# EAGLE design ppm_to_spektrum (EAGLE 5.11)
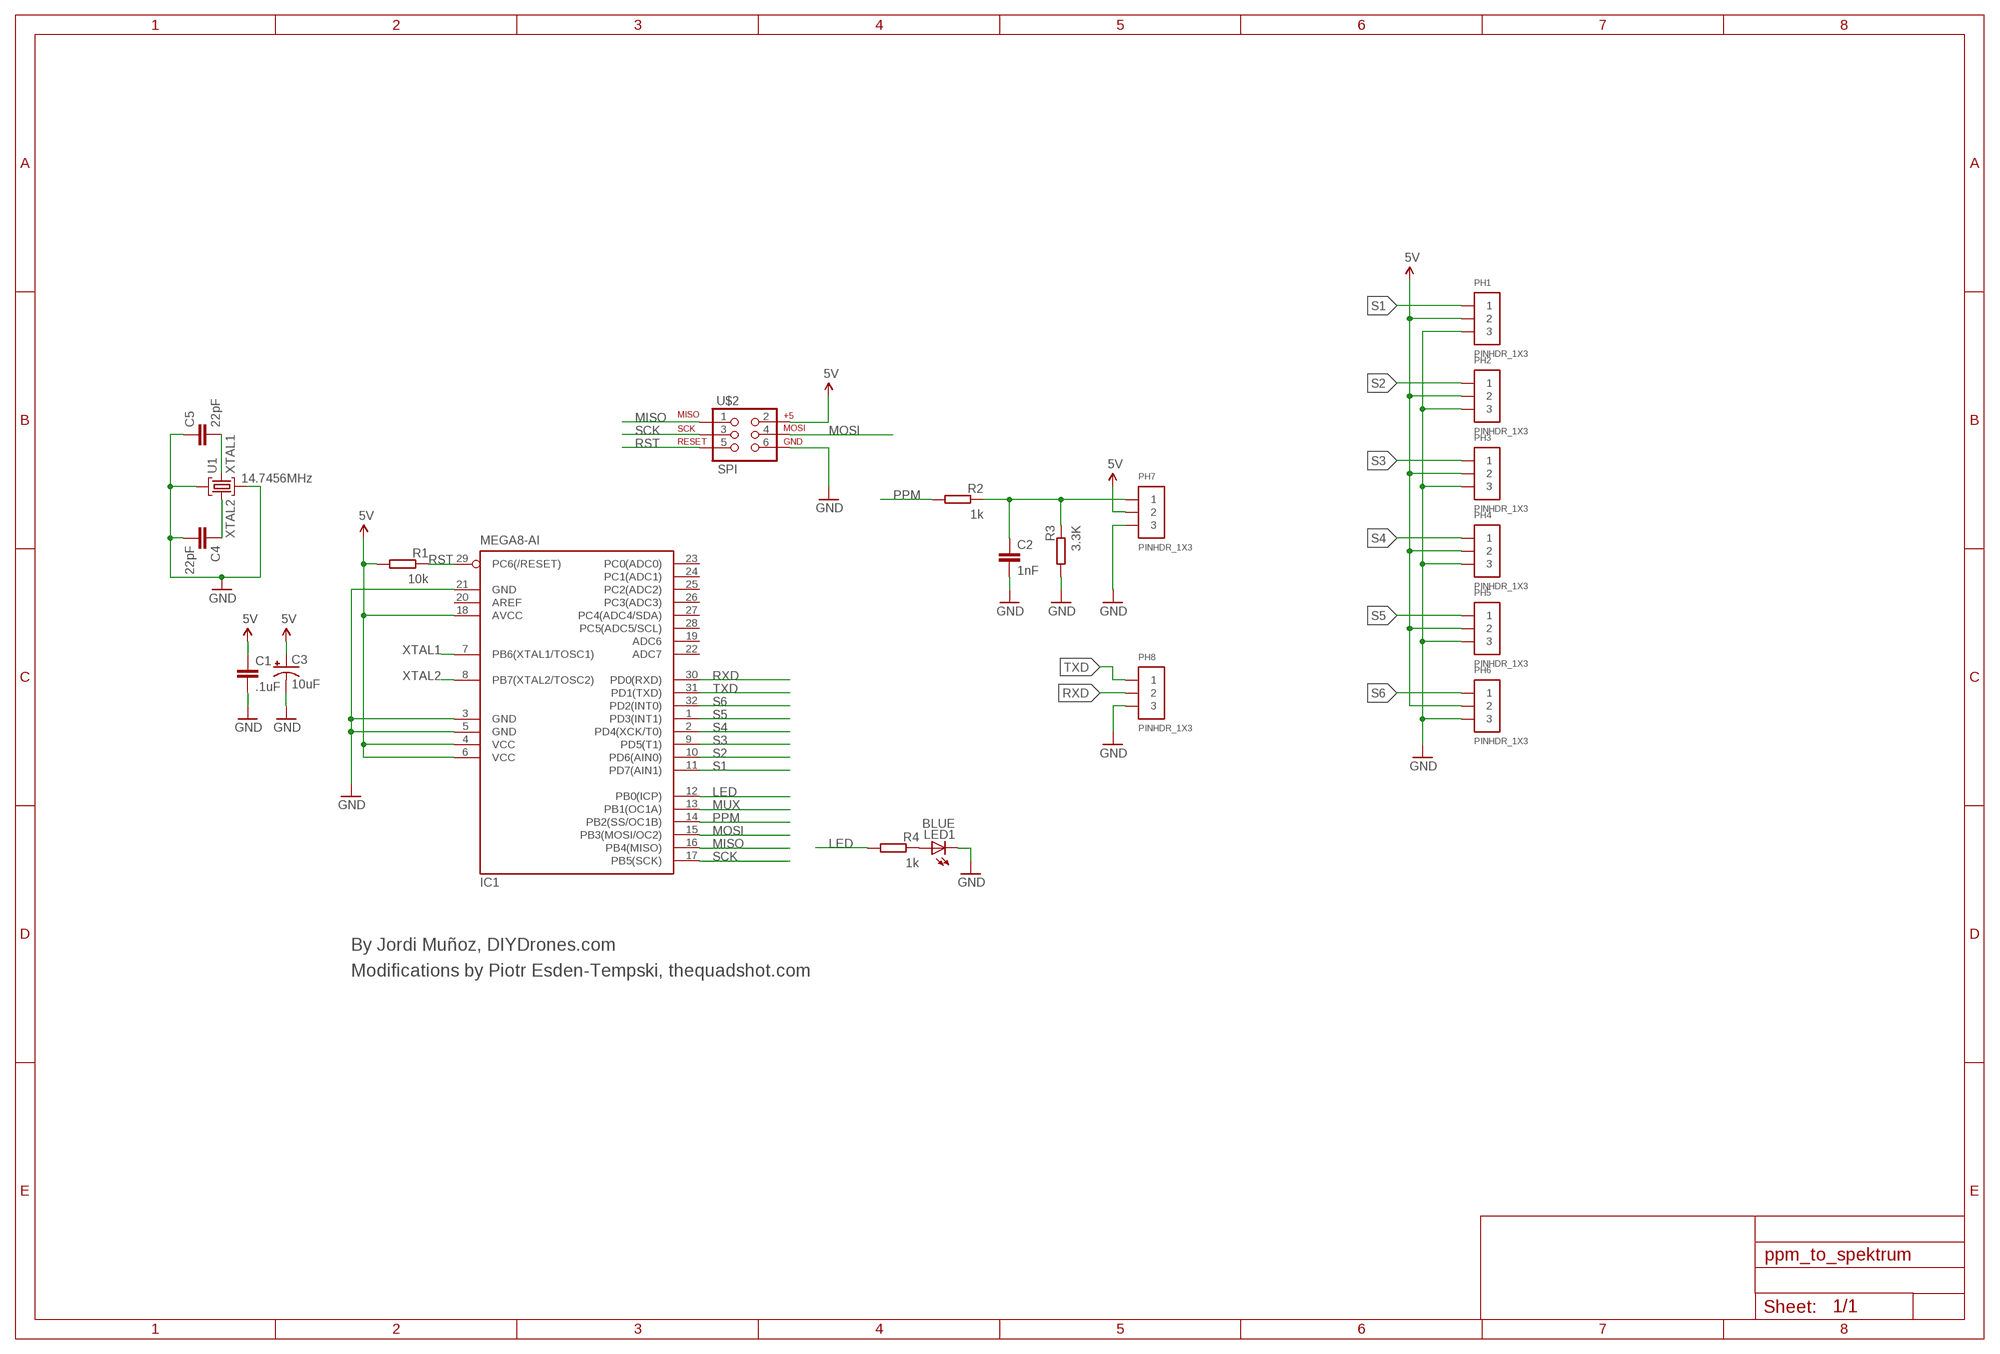
[diagram p0: schematic, sheet 1]

## Parts
C1  .1uF  CAPACITOR-0603  [0603-CAP]
C2  1nF  CAPACITOR-0603  [0603-CAP]
C3  10uF  CAP_POL1206  [EIA3216]
C4  22pF  CAPACITOR-0603  [0603-CAP]
C5  22pF  CAPACITOR-0603  [0603-CAP]
IC1  MEGA8-AI  [TQFP32-08]
LED1  BLUE  LED-0603  [0603-LED]
PH1  PINHDR_1X3  [PINHDR_1X3]
PH2  PINHDR_1X3  [PINHDR_1X3]
PH3  PINHDR_1X3  [PINHDR_1X3]
PH4  PINHDR_1X3  [PINHDR_1X3]
PH5  PINHDR_1X3  [PINHDR_1X3]
PH6  PINHDR_1X3  [PINHDR_1X3]
PH7  PINHDR_1X3  [PINHDR_1X3]
PH8  PINHDR_1X3  [PINHDR_1X3]
R1  10k  RESISTOR-0603  [0603-RES]
R2  1k  RESISTOR-0603  [0603-RES]
R3  3.3K  RESISTOR-0603  [0603-RES]
R4  1k  RESISTOR-0603  [0603-RES]
U1  14.7456MHz  CRYSTAL  [ABM8G]
U$2  SPI  AVR_SPI_PRG_6NS  [2X3-NS]

## Nets
5V: C1.P$1 C3.A(+) IC1.4(VCC) IC1.6(VCC) IC1.18(AVCC) PH1.2 PH2.2 PH3.2 PH4.2 PH5.2 PH6.2 PH7.2 R1.P$2 U$2.2
GND: C1.P$2 C2.P$2 C3.C(-) C4.P$2 C5.P$1 IC1.3(GND) IC1.5(GND) IC1.21(GND) LED1.C PH1.3 PH2.3 PH3.3 PH4.3 PH5.3 PH6.3 PH7.3 PH8.3 R3.P$2 U1.2 U1.4 U$2.6
LED: IC1.12(PB0(ICP)) R4.P$2
MISO: IC1.16(PB4(MISO)) U$2.1
MOSI: IC1.15(PB3(MOSI/OC2)) U$2.4
MUX: IC1.13(PB1(OC1A))
N$9: C2.P$1 PH7.1 R2.P$1 R3.P$1
N$10: LED1.A R4.P$1
PPM: IC1.14(PB2(SS/OC1B)) R2.P$2
RST: IC1.29(PC6(/RESET)) R1.P$1 U$2.5
RXD: IC1.30(PD0(RXD)) PH8.2
S1: IC1.11(PD7(AIN1)) PH1.1
S2: IC1.10(PD6(AIN0)) PH2.1
S3: IC1.9(PD5(T1)) PH3.1
S4: IC1.2(PD4(XCK/T0)) PH4.1
S5: IC1.1(PD3(INT1)) PH5.1
S6: IC1.32(PD2(INT0)) PH6.1
SCK: IC1.17(PB5(SCK)) U$2.3
TXD: IC1.31(PD1(TXD)) PH8.1
XTAL1: C5.P$2 IC1.7(PB6(XTAL1/TOSC1)) U1.3
XTAL2: C4.P$1 IC1.8(PB7(XTAL2/TOSC2)) U1.1
Unconnected: IC1.19(ADC6) IC1.20(AREF) IC1.22(ADC7) IC1.23(PC0(ADC0)) IC1.24(PC1(ADC1)) IC1.25(PC2(ADC2)) IC1.26(PC3(ADC3)) IC1.27(PC4(ADC4/SDA)) IC1.28(PC5(ADC5/SCL))

## Notes on the sheet
- By Jordi Muñoz, DIYDrones.com
- Modifications by Piotr Esden-Tempski, thequadshot.com

## Library data of the parts
C1 C2 C4 C5 = pel_dipol_comp:CAPACITOR
C3 = DIYdrones3:CAP_POL: Capacitor Polarized These are standard SMD and PTH capacitors. Normally 10uF, 47uF, and 100uF in electrolytic and tantalum varieties. Always verify the external diameter of the through hole cap, it varies with capacity, voltage, and manufacturer. The EIA devices should be standard.
IC1 = atmel:MEGA8: MICROCONTROLLER 8 Kbytes FLASH, 1 kbytes SRAM, 512 bytes EEPROM, USART, 6-channel 10 bit ADC, 2-channel 8 bit ADC Pin compatible with Atmega48, ATMega88, ATMega168 Source: avr.lbr
LED1 = pel_dipol_comp:LED
PH1-PH8 = ppm_to_spektrum:PINHDR_1X3
R1-R4 = pel_dipol_comp:RESISTOR
U1 = ppm_to_spektrum:CRYSTAL
U$2 = DIYdrones3:AVR_SPI_PRG_6: AVR ISP 6 Pin This is the reduced ISP connector for AVR programming. Common on Arduino. This footprint will take up less PCB space and can be used with a 10-pin to 6-pin adapter such as SKU: BOB-08508

## Board
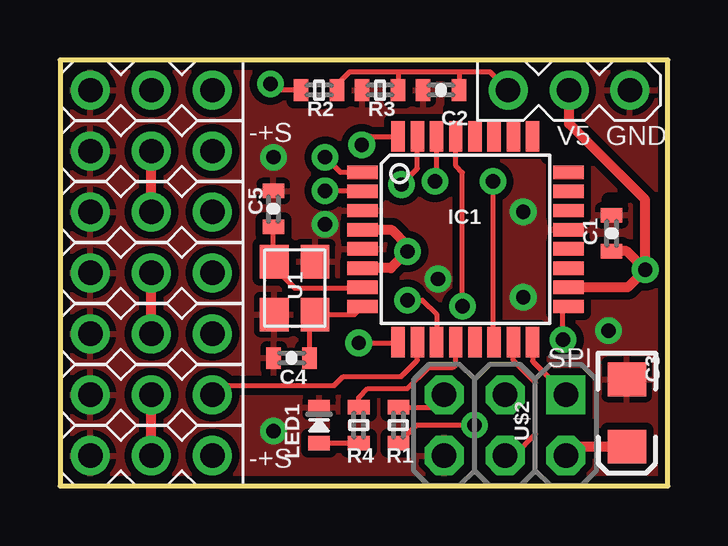
[diagram p1: board, top side]
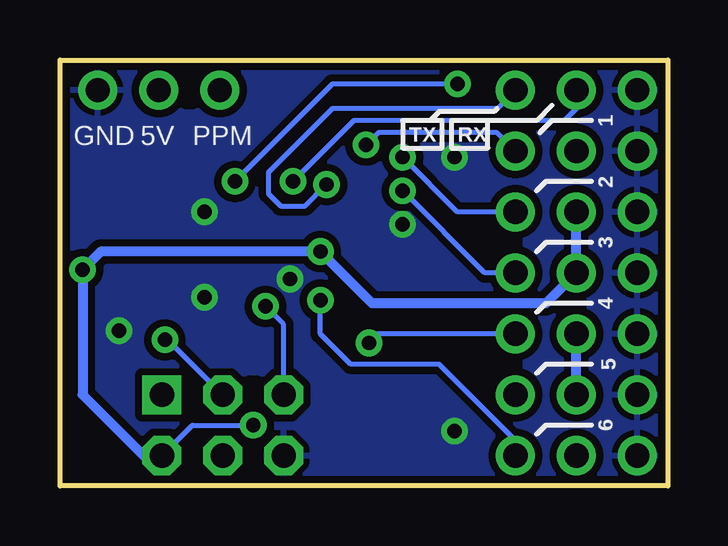
[diagram p2: board, bottom side, seen from below]

Size 25.32 x 17.77 mm. Coordinates in mm from the lower left corner, seen from the top.
Outline: 0,0 25.32,0 25.32,17.77 0,17.77 0,0
Copper layers (1*16): Top 0.035mm / dielectric 1.5mm / Bottom 0.035mm
Design rules "SparkFun *": minimum track width 8mil, minimum drill 20mil, track to track 8mil, track to pad 8mil, pad to pad 8mil, via to via 8mil, smd to smd 8mil, copper to edge 10mil, drill to drill 8mil, minimum pad ring 12mil, minimum via ring 10mil, stop-mask expansion 4mil, vias tented up to drill 24mil, thermal gap 10mil
tRestrict: area 20.3,13.7 to 20.4,14; area 17.1,1.1 to 17.3,1.4; area 11.6,2.4 to 11.7,2.7; area 10.7,16 to 10.9,16.1; area 16.3,15.5 to 16.4,15.7; area 22.9,11.8 to 23.1,11.9; area 9.5,5.2 to 9.7,5.5; area 22,2.3 to 22.1,2.5
bRestrict: area 6.3,5 to 6.5,5.2; area 19.8,16 to 20.1,16.1; area 17.1,1.1 to 17.3,1.4; area 17.1,4.2 to 17.4,4.3; area 3.7,7.5 to 3.8,7.7; area 6.3,10 to 6.5,10.3

### Footprints (pad centres in the part's own frame; a part is rotated, then mirrored left to right if it is on the bottom)
0603-CAP = smd 0.6 x 0.9: P$1 -0.75,0; P$2 0.75,0
EIA3216 = smd 1.4 x 1.6: A 1.4,0; C -1.4,0
TQFP32-08 = smd 1.27 x 0.559: 1 -4.293,2.8; 2 -4.293,2; 3 -4.293,1.2; 4 -4.293,0.4; 5 -4.293,-0.4; 6 -4.293,-1.2; 7 -4.293,-2; 8 -4.293,-2.8; 17 4.293,-2.8; 18 4.293,-2; 19 4.293,-1.2; 20 4.293,-0.4; 21 4.293,0.4; 22 4.293,1.2; 23 4.293,2; 24 4.293,2.8 | smd 0.559 x 1.27: 9 -2.8,-4.293; 10 -2,-4.293; 11 -1.2,-4.293; 12 -0.4,-4.293; 13 0.4,-4.293; 14 1.2,-4.293; 15 2,-4.293; 16 2.8,-4.293; 25 2.8,4.293; 26 2,4.293; 27 1.2,4.293; 28 0.4,4.293; 29 -0.4,4.293; 30 -1.2,4.293; 31 -2,4.293; 32 -2.8,4.293
0603-LED = smd 0.6 x 0.9: A 0.75,0; C -0.75,0
PINHDR_1X3 = drill 1.016 round: 1 2.54,0; 2 0,0; 3 -2.54,0
0603-RES = smd 0.6 x 0.9: P$1 -0.75,0; P$2 0.75,0
ABM8G = smd 1.397 x 1.194: 1 -1.105,-0.851; 2 1.105,-0.851; 3 1.105,0.851; 4 -1.105,0.851
2X3-NS = drill 1.016 square: 1 -2.54,-1.27 | drill 1.016 octagon: 2 -2.54,1.27; 3 0,-1.27; 4 0,1.27; 5 2.54,-1.27; 6 2.54,1.27

### Placement (x,y rotation side)
C1  22.99,10.54 90 top
C2  15.88,16.51 180 top
C3  23.62,3.05 270 top
C4  9.65,5.33 180 top
C5  8.89,11.56 270 top
IC1  16.89,10.29 0 top
LED1  10.79,2.54 270 top
PH1  3.81,1.27 0 top
PH2  3.81,3.81 0 top
PH3  3.81,6.35 0 top
PH4  3.81,8.89 0 top
PH5  3.81,11.43 0 top
PH6  3.81,13.97 0 top
PH7  21.21,16.51 180 top
PH8  3.81,16.51 0 top
R1  14.1,2.54 270 top
R2  10.79,16.51 180 top
R3  13.34,16.51 180 top
R4  12.45,2.54 90 top
U1  9.78,8.26 90 top
U$2  18.54,2.54 180 top

### Tracks (layer width: path | path; a pad name or v marks a point on that pad's centre or on a via)
5V  (via drill 0.6)
  Top 0.203: R1.P$2 14.85,2.54 v17.27,2.54
  Top 0.406: PH1.2 PH2.2 | PH3.2 PH4.2 | PH5.2 PH6.2 | IC1.4 12.62,10.67 13.84,10.67 14.48,10.03 v14.48,9.78 13.79,9.09 IC1.6 | U$2.2 21.46,1.65 C3.A | v24.38,9.02 24.38,11.94 21.21,15.11 PH7.2 | v24.38,9.02 23.61,9.79 C1.P$1 | IC1.18 23.65,8.29 v24.38,9.02
  Bottom 0.203: v17.27,2.54 19.81,2.54 U$2.2
  Bottom 0.406: PH2.2 PH3.2 | PH5.2 PH4.2 5.08,7.62 12.32,7.62 v14.48,9.78 23.62,9.78 v24.38,9.02 24.38,3.81 21.84,1.27 U$2.2
GND  (via drill 0.6)
  other vias: 19.3,11.43 8.89,13.72 22.86,6.48 19.3,7.87 8.89,2.29 15.75,8.64 11.05,10.92
  pour Top (isolate 0.305): 0,17.78 25.27,17.78 25.27,0 0,0
  pour Bottom (isolate 0.305): 0,17.78 25.27,17.78 25.27,0 0,0
LED
  Top 0.203: R4.P$2 12.45,3.68 12.83,4.06 14.48,4.06 15.37,4.95 16.38,4.95 16.49,5.06 IC1.12
MISO
  Top 0.203: U$2.1 19.69,5.2 IC1.16
MOSI
  Top 0.203: U$2.4 18.92,1.27 19.81,2.16 19.81,4.32 18.89,5.24 IC1.15
N$9
  Top 0.203: R2.P$1 11.54,16.75 12.06,17.27 14.1,17.27 | 14.1,17.27 16.64,17.27 | 16.64,17.27 17.91,17.27 PH7.1 | C2.P$1 16.64,16.52 16.64,17.27 | R3.P$1 14.1,16.52 14.1,17.27
N$10
  Top 0.203: R4.P$1 LED1.A
PPM  (via drill 0.6)
  Top 0.203: R2.P$2 9.02,16.51 v8.76,16.76 | v18.03,12.7 18.03,6.05 IC1.14
  Bottom 0.203: v8.76,16.76 13.97,16.76 v18.03,12.7
RST  (via drill 0.6)
  Top 0.203: IC1.29 16.49,13.35 16.76,13.08 v16.76,7.49 | U$2.5 15.48,3.29 R1.P$1
  Bottom 0.203: v16.76,7.49 16,6.73 U$2.5
RXD  (via drill 0.6)
  Top 0.203: v15.62,12.7 15.69,12.77 IC1.30
  Bottom 0.203: PH8.2 3.81,15.75 4.32,15.24 13.08,15.24 v15.62,12.7
S1  (via drill 0.6)
  Top 0.203: IC1.11 15.69,7.17 15.11,7.75 v14.48,7.75
  Bottom 0.203: PH1.1 6.35,1.91 9.53,5.08 13.21,5.08 14.48,6.35 v14.48,7.75
S2
  Top 0.203: IC1.10 14.89,5.24 14.22,4.57 11.81,4.57 11.43,4.19 6.73,4.19 PH2.1
S3  (via drill 0.6)
  Top 0.203: IC1.9 14.07,5.97 v12.45,5.97
  Bottom 0.203: v12.45,5.97 12.06,6.35 PH3.1
S4  (via drill 0.6)
  Top 0.203: v11.05,12.32 12.57,12.32 IC1.2
  Bottom 0.203: PH4.1 7.62,8.89 v11.05,12.32
S5  (via drill 0.6)
  Top 0.203: v11.05,13.72 11.68,13.09 IC1.1
  Bottom 0.203: PH5.1 8.76,11.43 v11.05,13.72
S6  (via drill 0.6)
  Top 0.203: v12.57,14.22 12.93,14.58 IC1.32
  Bottom 0.203: PH6.1 7.11,14.73 12.06,14.73 v12.57,14.22
SCK  (via drill 0.6)
  Top 0.203: IC1.17 20.95,7.26 v20.95,6.1
  Bottom 0.203: U$2.3 20.83,6.1 v20.95,6.1
TXD  (via drill 0.6)
  Top 0.203: v14.22,12.57 14.89,13.24 IC1.31
  Bottom 0.203: PH8.1 7.11,15.75 13.97,15.75 16.64,13.08 16.64,12.19 16.13,11.68 15.11,11.68 v14.22,12.57
XTAL1
  Top 0.203: IC1.7 12.57,8.26 9.78,8.26 8.93,9.11 U1.3 8.89,9.4 C5.P$2
XTAL2
  Top 0.203: IC1.8 12.26,7.15 U1.1 10.4,6.92 C4.P$1

### Text on the board
tPlace: -+S | V5 | GND | SPI | -+S
bPlace: 1 | RX | TX | PPM | 5V | GND | 2 | 3 | 4 | 5 | 6
Document: By Jordi Muñoz, DIYDrones.com | Modifications by Piotr Esden-Tempski, thequadshot.com